# Altium project Telemetry_Board.PrjPcb
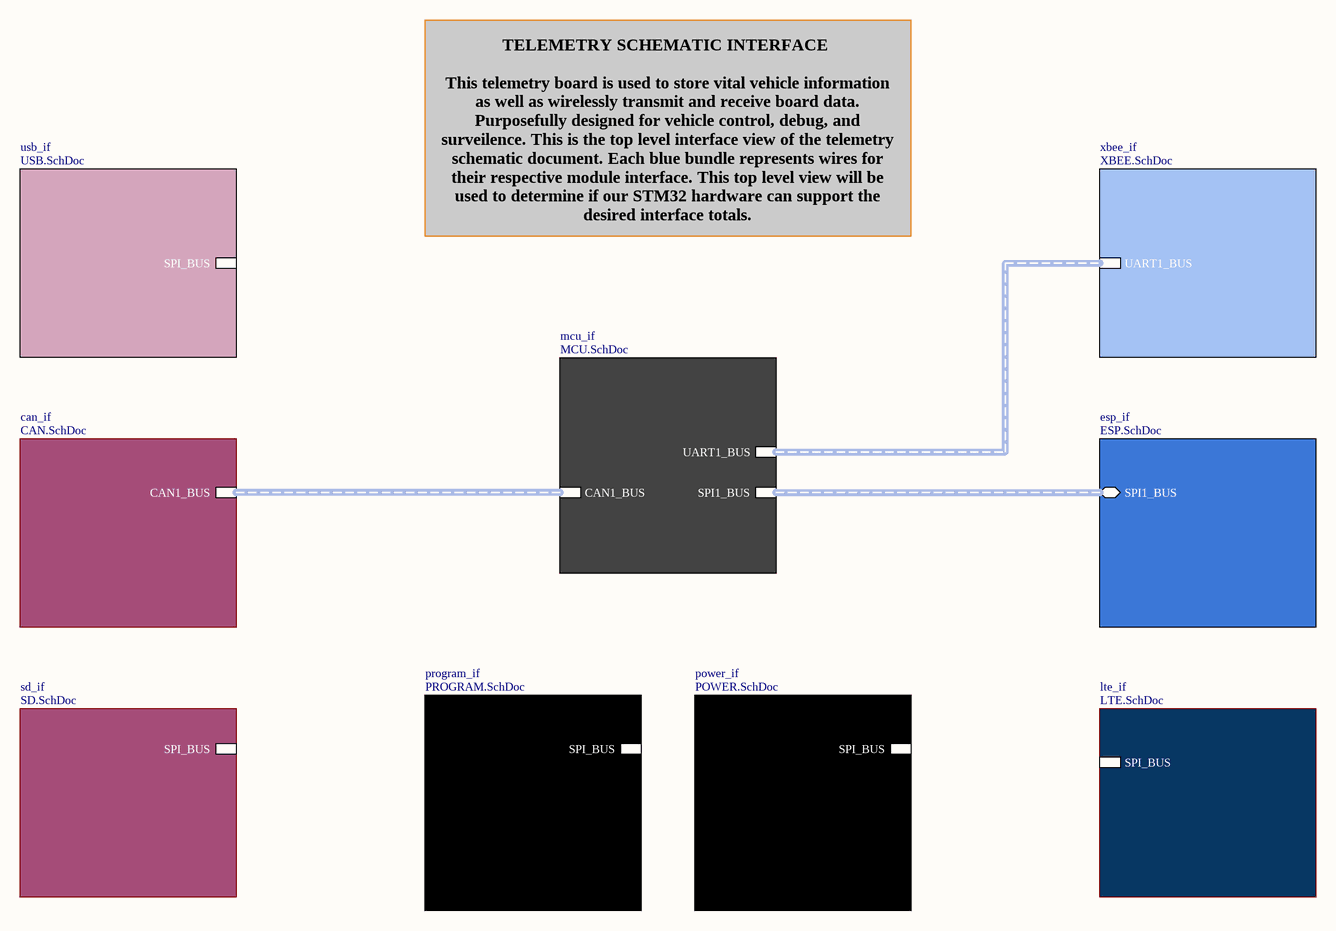
[diagram p0: Telemetry.SchDoc]
10 sheets, 38 parts. Net scope: hierarchical (ports join the sheet entries above them; power ports are global).
Board file: Telemetry.PcbDoc
Sheets:
  Telemetry.SchDoc
    mcu_if = MCU.SchDoc
    esp_if = ESP.SchDoc
    xbee_if = XBEE.SchDoc
    usb_if = USB.SchDoc
    can_if = CAN.SchDoc
    lte_if = LTE.SchDoc
    program_if = PROGRAM.SchDoc
    sd_if = SD.SchDoc
    power_if = POWER.SchDoc

## Sheet Telemetry.SchDoc
size 381 x 241 mm; SheetNumber: 1; SheetTotal: 10

### Sub-sheets
can_if = CAN.SchDoc: CAN1_BUS (harness SPI_BUS)
esp_if = ESP.SchDoc: SPI1_BUS (bidir, harness SPI_BUS)
lte_if = LTE.SchDoc: SPI_BUS (harness SPI_BUS)
mcu_if = MCU.SchDoc: SPI1_BUS (harness SPI_BUS), UART1_BUS (harness SPI_BUS), CAN1_BUS (harness SPI_BUS)
power_if = POWER.SchDoc: SPI_BUS (harness SPI_BUS)
program_if = PROGRAM.SchDoc: SPI_BUS (harness SPI_BUS)
sd_if = SD.SchDoc: SPI_BUS (harness SPI_BUS)
usb_if = USB.SchDoc: SPI_BUS (harness SPI_BUS)
xbee_if = XBEE.SchDoc: UART1_BUS (harness SPI_BUS)

### Buses and harness runs
harness sheet can_if/CAN1_BUS = sheet mcu_if/CAN1_BUS
harness sheet esp_if/SPI1_BUS = sheet mcu_if/SPI1_BUS
harness sheet mcu_if/UART1_BUS = sheet xbee_if/UART1_BUS

### Notes on the sheet
- TELEMETRY SCHEMATIC INTERFACE
  This telemetry board is used to store vital vehicle information as well as wirelessly transmit and receive board data. Purposefully designed for vehicle control, debug, and surveilence. This is the top level interface view of the telemetry schematic document. Each blue bundle represents wires for their respective module interface. This top level view will be used to determine if our STM32 hardware can support the desired interface totals.

## Sheet MCU.SchDoc
size A; SheetNumber: 2; SheetTotal: 9
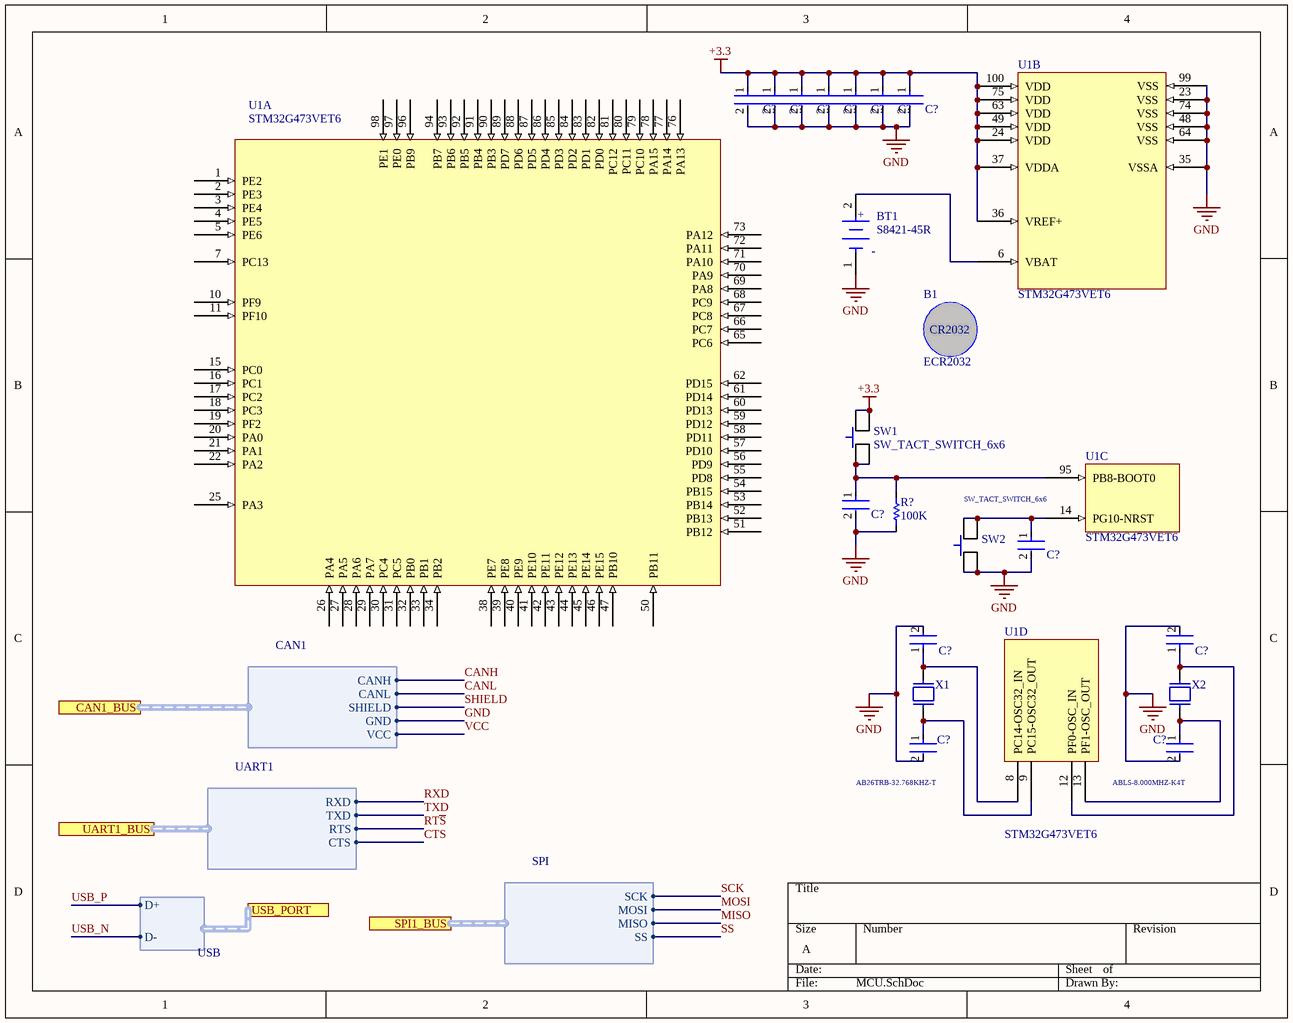
[diagram p1: MCU.SchDoc]

### Parts
(Parts that share a designator on the sheet are numbered #1, #2 ... from top to bottom, then left to right.)
B1  ECR2032
BT1  S8421-45R  [FP-S8421-45R-MFG]
C?#1  C0603C104K5RAC7411  [FP-C0603C-CF-IPC_B]  (value not drawn)
C?#2  C0603C104K5RAC7411  [FP-C0603C-CF-IPC_B]  (value not drawn)
C?#3  C0603C104K5RAC7411  [FP-C0603C-CF-IPC_B]  (value not drawn)
C?#4  C0603C104K5RAC7411  [FP-C0603C-CF-IPC_B]  (value not drawn)
C?#5  C0603C104K5RAC7411  [FP-C0603C-CF-IPC_B]  (value not drawn)
C?#6  C0603C104K5RAC7411  [FP-C0603C-CF-IPC_B]  (value not drawn)
C?#7  C0603C104K5RAC7411  [FP-C0603C-CF-IPC_B]  (value not drawn)
C?#8  C0603C104K5RAC7411  [FP-C0603C-CF-IPC_B]  (value not drawn)
C?#9  C0603C104K5RAC7411  [FP-C0603C-CF-IPC_B]  (value not drawn)
C?#10  C0603C104K5RAC7411  [FP-C0603C-CF-IPC_B]  (value not drawn)
C?#11  C0603C104K5RAC7411  [FP-C0603C-CF-IPC_B]  (value not drawn)
C?#12  C0603C104K5RAC7411  [FP-C0603C-CF-IPC_B]  (value not drawn)
C?#13  C0603C104K5RAC7411  [FP-C0603C-CF-IPC_B]  (value not drawn)
R?  value 100K  [0603_RESISTOR]  (hidden comment: R_0603_100K_1%)
SW1  SW_TACT_SWITCH_6x6  [TACT_SWITCH_6x6_J-LEAD]
SW2  SW_TACT_SWITCH_6x6  [TACT_SWITCH_6x6_J-LEAD]
U1  STM32G473VET6  [TSQFP50P1600X1600X160-100N]  (parts A,B,C,D of 4)
X1  AB26TRB-32.768KHZ-T  [X_2.1mm_RADIAL_CRYSTAL]
X2  ABLS-8.000MHZ-K4T  [ABLS-8.000MHZ-K4T-Footprint-1]

### Ports
CAN1_BUS (harness CAN1), SPI1_BUS (harness SPI), UART1_BUS (harness UART1), USB_PORT (harness USB)

### Harnesses
SPI: SCK, MOSI, MISO, SS
UART1: RXD, TXD, RTS, CTS
CAN1: CANH, CANL, SHIELD, GND, VCC
USB: D+, D-

### Nets
+3.3: C?#1.1 C?#2.1 C?#3.1 C?#4.1 C?#5.1 C?#6.1 C?#7.1 SW1.2 SW1.3 U1.24(VDD) U1.36(VREF+) U1.37(VDDA) U1.49(VDD) U1.63(VDD) U1.75(VDD) U1.100(VDD)
GND: BT1.1(C) C?#1.2 C?#2.2 C?#3.2 C?#4.2 C?#5.2 C?#6.2 C?#7.2 C?#8.2 C?#9.2 C?#10.2 C?#11.2 C?#12.2 C?#13.2 R?.1 SW2.1 SW2.4 U1.23(VSS) U1.35(VSSA) U1.48(VSS) U1.64(VSS) U1.74(VSS) ; port CAN1_BUS.GND
CANH: port CAN1_BUS.CANH
CANL: port CAN1_BUS.CANL
CTS: port UART1_BUS.CTS
MISO: port SPI1_BUS.MISO
MOSI: port SPI1_BUS.MOSI
RT~{S}: port UART1_BUS.RTS
RXD: port UART1_BUS.RXD
SCK: port SPI1_BUS.SCK
SHIELD: port CAN1_BUS.SHIELD
SS: port SPI1_BUS.SS
TXD: port UART1_BUS.TXD
USB_N: port USB_PORT.D-
USB_P: port USB_PORT.D+
VCC: port CAN1_BUS.VCC
NetBT1_2: BT1.2(A) U1.6(VBAT)
NetC?#8_1: C?#8.1 R?.2 SW1.1 SW1.4 U1.95(PB8-BOOT0)
NetC?#9_1: C?#9.1 SW2.2 SW2.3 U1.14(PG10-NRST)
NetC?#10_1: C?#10.1 U1.8(PC14-OSC32_IN) X1.1
NetC?#11_1: C?#11.1 U1.12(PF0-OSC_IN) X2.1
NetC?#12_1: C?#12.1 U1.9(PC15-OSC32_OUT) X1.2
NetC?#13_1: C?#13.1 U1.13(PF1-OSC_OUT) X2.2

Not connected (* = marked no-connect by the designer): U1 1(PE2) 2(PE3) 3(PE4) 4(PE5) 5(PE6) 7(PC13) 10(PF9) 11(PF10) 15(PC0) 16(PC1) 17(PC2) 18(PC3) 19(PF2) 20(PA0) 21(PA1) 22(PA2) 25(PA3) 26(PA4) 27(PA5) 28(PA6) 29(PA7) 30(PC4) 31(PC5) 32(PB0) 33(PB1) 34(PB2) 38(PE7) 39(PE8) 40(PE9) 41(PE10) 42(PE11) 43(PE12) 44(PE13) 45(PE14) 46(PE15) 47(PB10) 50(PB11) 51(PB12) 52(PB13) 53(PB14) 54(PB15) 55(PD8) 56(PD9) 57(PD10) 58(PD11) 59(PD12) 60(PD13) 61(PD14) 62(PD15) 65(PC6) 66(PC7) 67(PC8) 68(PC9) 69(PA8) 70(PA9) 71(PA10) 72(PA11) 73(PA12) 76(PA13) 77(PA14) 78(PA15) 79(PC10) 80(PC11) 81(PC12) 82(PD0) 83(PD1) 84(PD2) 85(PD3) 86(PD4) 87(PD5) 88(PD6) 89(PD7) 90(PB3) 91(PB4) 92(PB5) 93(PB6) 94(PB7) 96(PB9) 97(PE0) 98(PE1) 99(VSS)

### Notes on the sheet
- (in symbol CMP-001-0000-1) +; -
- (in symbol CMP-001-0001-1) CR2032

### Library data of the parts
B1 = CMP-001-0001-1: CR2032 BATTERY LITH 3V COIN 20MM STRIP
BT1 = CMP-001-0000-1: HARWIN - S8421-45R - HOLDER, COIN CELL, CR2032
C?#1-C?#13 = CMP-001-00083-3: Cap Ceramic 0.1uF 50V X7R 10% SMD 0603 125C T/R
R? = CMP-058-000032-1: RES 100K OHM 1/16W 1% 0603 SMD; Manufacturer: TE Connectivity Passive Product; Manufacturer Part Number: CPF0603F100KC1; Power Rating: 0.0625W; SVP Creator: Spencer Berglund; Source: resistor.SchLib; ComponentLink1Description: DigiKey; Design Item ID: R_0603_100K_1%; DigiKey PN: A102199TR-ND; Package: 0603_RESISTOR; ComponentLink1URL: https://www.digikey.com/products/en?keywords=A102199TR-ND
SW1 SW2 = CMP-050-000002-1: SWITCH TACT 6MM BLACK 160GF; SVP Creator: Spencer Berglund; Design Item ID: SW_TACT_SWITCH_6x6; Source: misc.SchLib; Package: 6mm x 6mm
U1 = CMP-00014-4: RISC Microcontroller, 32-Bit, 170MHz; Interface: JTAG; RAM Size: 128; Frequency: 170Hz; Nominal Supply Voltage: 3.3V; Case/Package: LQFP100; RoHS Compliant: Yes; Mounting Technology: SMD; Pins: 100
X1 = CMP-046-000002-2: CRYSTAL 32.7680KHZ 12.5PF SMD; Source: misc.SchLib; Design Item ID: X_32.768kHz_CRYSTAL
X2 = CMP-003-00030-1: ABRACON         ABLS-8.000MHZ-K4T             CRYSTAL, 8MHZ, 18PF, HC-49US

## Sheet ESP.SchDoc
size A; SheetNumber: 7; SheetTotal: 9
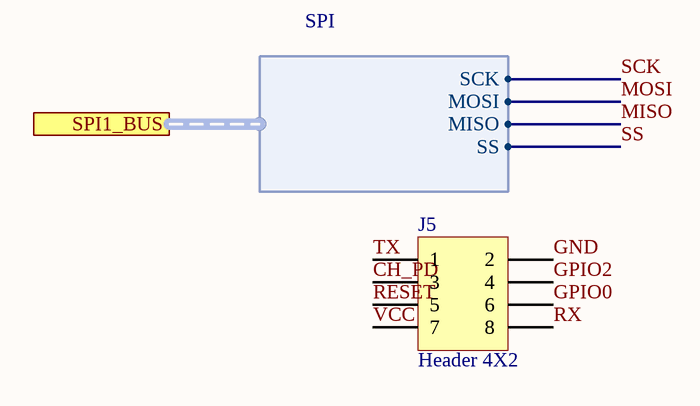
[diagram p2: ESP.SchDoc]

### Parts
J5  Header 4X2  [HDR2X4]

### Ports
SPI1_BUS (harness SPI)

### Harnesses
SPI: SCK, MOSI, MISO, SS

### Nets
CH_PD: J5.3
GND: J5.2
GPIO0: J5.6
GPIO2: J5.4
MISO: port SPI1_BUS.MISO
MOSI: port SPI1_BUS.MOSI
RESET: J5.5
RX: J5.8
SCK: port SPI1_BUS.SCK
SS: port SPI1_BUS.SS
TX: J5.1
VCC: J5.7

### Library data of the parts
J5 = Header 4X2: Header, 4-Pin, Dual row; LatestRevisionDate: 17-Jul-2002; LatestRevisionNote: Re-released for DXP Platform.; Publisher: Altium Limited

## Sheet XBEE.SchDoc
size A; SheetNumber: 6; SheetTotal: 10
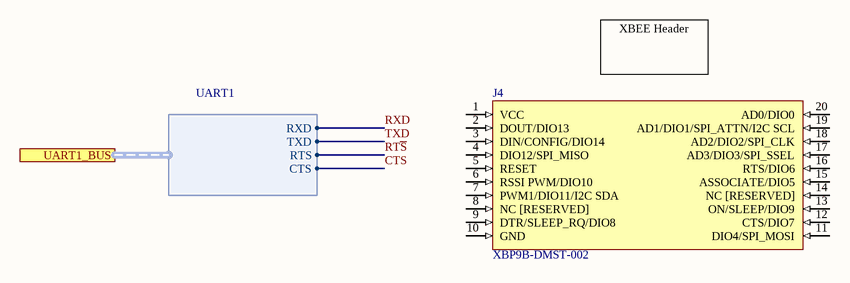
[diagram p3: XBEE.SchDoc]

### Parts
J4  XBP9B-DMST-002  [XBP9B-DMST-002-Footprint-1]

### Ports
UART1_BUS (harness UART1)

### Harnesses
UART1: RXD, TXD, RTS, CTS

### Nets

Not connected (* = marked no-connect by the designer): J4 1(VCC) 2(DOUT/DIO13) 3(DIN/CONFIG/DIO14) 4(DIO12/SPI_MISO) 5(RESET) 6(RSSI_PWM/DIO10) 7(PWM1/DIO11/I2C_SDA) 8(NC_[RESERVED]) 9(DTR/SLEEP_RQ/DIO8) 10(GND) 11(DIO4/SPI_MOSI) 12(CTS/DIO7) 13(ON/SLEEP/DIO9) 14(NC_[RESERVED]) 15(ASSOCIATE/DIO5) 16(RTS/DIO6) 17(AD3/DIO3/SPI_SSEL) 18(AD2/DIO2/SPI_CLK) 19(AD1/DIO1/SPI_ATTN/I2C_SCL) 20(AD0/DIO0)

### Notes on the sheet
- (near J4) XBEE Header

### Library data of the parts
J4 = CMP-00025-00003-1: 802.15.4 LR-WPAN SOC 928MHz 200Kbps

## Sheet USB.SchDoc
size A; SheetNumber: 4; SheetTotal: 9
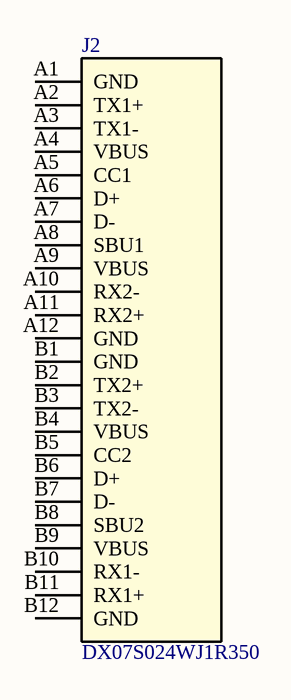
[diagram p4: USB.SchDoc]

### Parts
J2  DX07S024WJ1R350  [DX07S024WJ1R350-Footprint-1]

### Nets

Not connected (* = marked no-connect by the designer): J2 A1(GND) A2(TX1+) A3(TX1-) A4(VBUS) A5(CC1) A6(D+) A7(D-) A8(SBU1) A9(VBUS) A10(RX2-) A11(RX2+) A12(GND) B1(GND) B2(TX2+) B3(TX2-) B4(VBUS) B5(CC2) B6(D+) B7(D-) B8(SBU2) B9(VBUS) B10(RX1-) B11(RX1+) B12(GND)

### Library data of the parts
J2 = CMP-002-00075-3: Vertical Mount Type C receptacle; 12mm Height

## Sheet CAN.SchDoc
size A; SheetNumber: 3; SheetTotal: 9
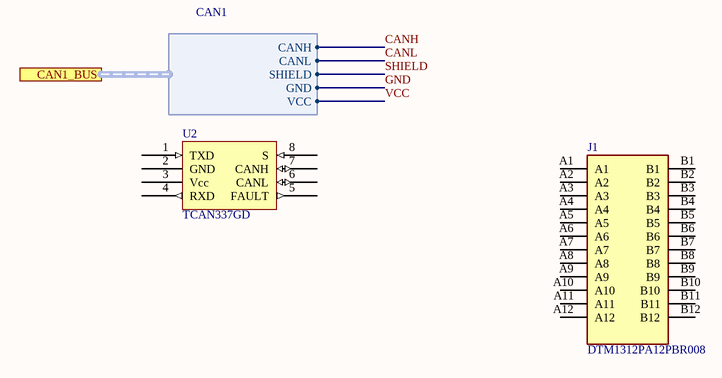
[diagram p5: CAN.SchDoc]

### Parts
J1  DTM1312PA12PBR008  [TE_DTM1312PA12PBR008]
U2  TCAN337GD  [TCAN337GD-Footprint-1]

### Ports
CAN1_BUS (harness CAN1)

### Harnesses
CAN1: CANH, CANL, SHIELD, GND, VCC

### Nets

Not connected (* = marked no-connect by the designer): J1 A1 A2 A3 A4 A5 A6 A7 A8 A9 A10 A11 A12 B1 B2 B3 B4 B5 B6 B7 B8 B9 B10 B11 B12; U2 1(TXD) 2(GND) 3(Vcc) 4(RXD) 5(FAULT) 6(CANL) 7(CANH) 8(S)

### Library data of the parts
J1 = CMP-002-00081-2: 24 way sealed A and B key PCB header with .165 inch/4.2 millimeter centerline pitch.; MP: DTM13-12PA-12PB-R008; MF: TE Connectivity; Component Type: Standard; Design Item ID: DTM1312PA12PBR008; Value: *; TE_purchase_URL: https://www.te.com/usa-en/product-DTM1312PA12PBR008.html?te_bu=Cor&te_type=disp&te_campaign=seda_glo_cor-seda-global-disp-prtnr-fy19-seda-model-bom-cta_sma-317_1&elqCampaignId=32493; Source: SnapEDAsch.SchLib; Pins: 24; Digi-Key_Part_Number: 1734-1131-ND; Case/Package: None; SnapEDA_Link: https://www.snapeda.com/parts/DTM13-12PA-12PB-R008/TE%20Connectivity%20Deutsch%20Connectors/view-part/490507/?ref=snap; Digi-Key_Purchase_URL: https://www.digikey.com/product-detail/en/te-connectivity-deutsch-connectors/DTM13-12PA-12PB-R008/1734-1131-ND/6566695?utm_source=snapeda&utm_medium=aggregator&utm_campaign=symbol
U2 = CMP-015-00008-1: 3.3-V CAN Transceivers with CAN FD (Flexible Data Rate) 8-SOIC -40 to 125 +-

## Sheet LTE.SchDoc
size A; SheetNumber: 7; SheetTotal: 9

## Sheet PROGRAM.SchDoc
size A; SheetNumber: 9; SheetTotal: 10
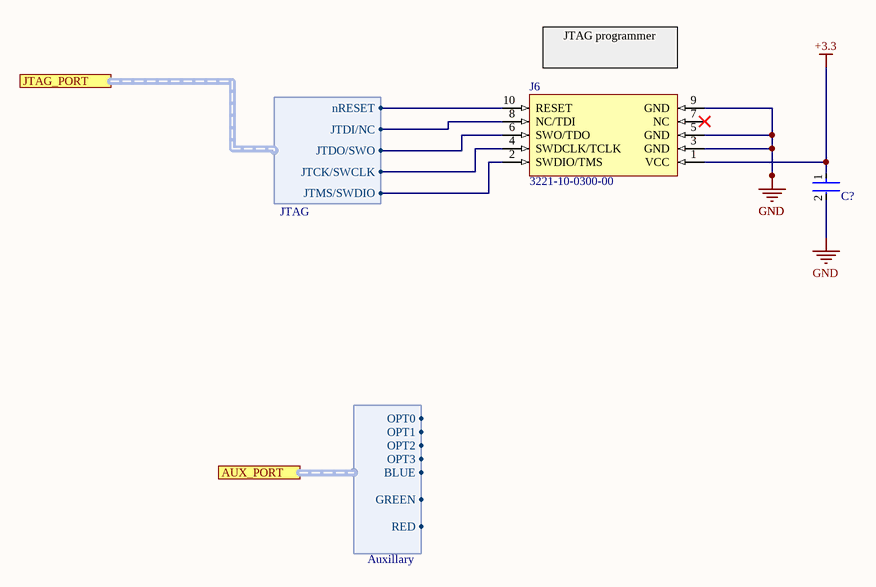
[diagram p6: PROGRAM.SchDoc]

### Parts
(Parts that share a designator on the sheet are numbered #1, #2 ... from top to bottom, then left to right.)
C?#14  C0603C104K5RAC7411  [FP-C0603C-CF-IPC_B]  (value not drawn)
J6  3221-10-0300-00  [3221-10-0300-00-Footprint-1]

### Ports
AUX_PORT (harness Auxillary), JTAG_PORT (harness JTAG)

### Harnesses
Auxillary: OPT0, OPT1, RED, GREEN, BLUE, OPT2, OPT3
JTAG: JTMS/SWDIO, JTCK/SWCLK, JTDO/SWO, JTDI/NC, nRESET

### Nets
+3.3: C?#14.1 J6.1(VCC)
GND: C?#14.2 J6.3(GND) J6.5(GND) J6.9(GND)
NetJ6_2: J6.2(SWDIO/TMS) ; port JTAG_PORT.JTMS/SWDIO
NetJ6_4: J6.4(SWDCLK/TCLK) ; port JTAG_PORT.JTCK/SWCLK
NetJ6_6: J6.6(SWO/TDO) ; port JTAG_PORT.JTDO/SWO
NetJ6_8: J6.8(NC/TDI) ; port JTAG_PORT.JTDI/NC
NetJ6_10: J6.10(RESET) ; port JTAG_PORT.nRESET

Not connected (* = marked no-connect by the designer): J6 7(NC)*

### Notes on the sheet
- (near J6) JTAG programmer

### Library data of the parts
C?#14 = CMP-001-00083-3: as C?#1 on sheet MCU
J6 = CMP-002-00077-1: JTAG STLINK CONN HEADER SMD 10POS 1.27MM

## Sheet SD.SchDoc
size A; SheetNumber: 5; SheetTotal: 9
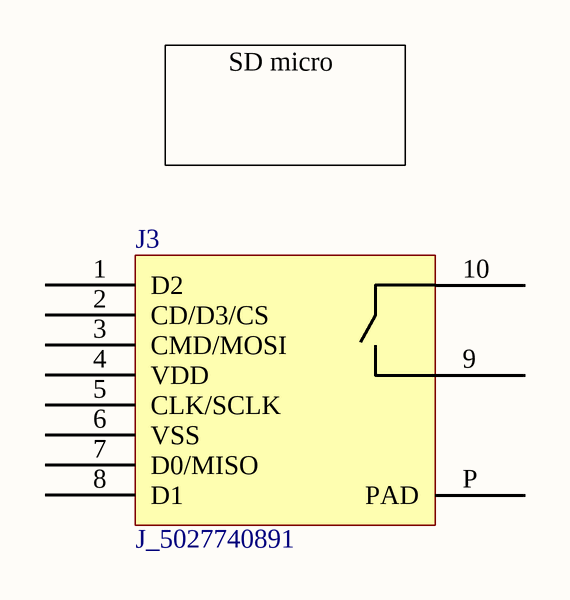
[diagram p7: SD.SchDoc]

### Parts
J3  J_5027740891  [usd slot 5027740891]

### Nets

Not connected (* = marked no-connect by the designer): J3 1(D2) 2(CD/D3/CS) 3(CMD/MOSI) 4(VDD) 5(CLK/SCLK) 6(VSS) 7(D0/MISO) 8(D1) 9 10 P(PAD)

### Notes on the sheet
- SD micro

### Library data of the parts
J3 = CMP-142-000000-4: CONN MICRO SD CARD PUSH-PUSH R/A; Max Current Rating: 500mA; Gender: Female; Mounting Technology: SMT; Pins: 12

## Sheet POWER.SchDoc
size A; SheetNumber: 10; SheetTotal: 10
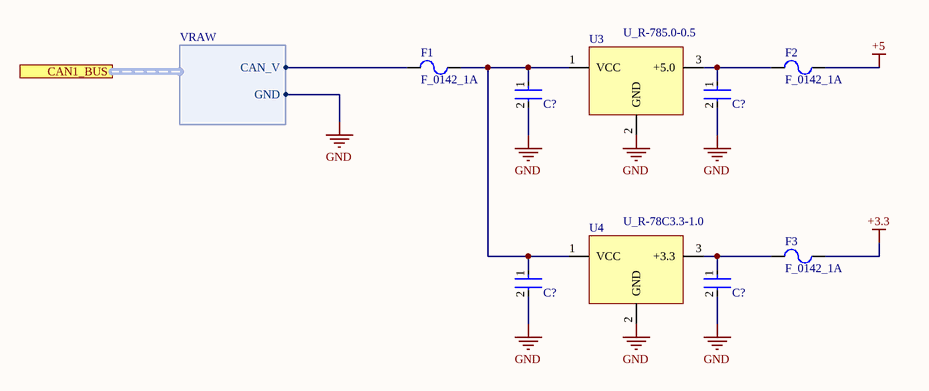
[diagram p8: POWER.SchDoc]

### Parts
(Parts that share a designator on the sheet are numbered #1, #2 ... from top to bottom, then left to right.)
C?#15  C0603C104K5RAC7411  [FP-C0603C-CF-IPC_B]  (value not drawn)
C?#16  C0603C104K5RAC7411  [FP-C0603C-CF-IPC_B]  (value not drawn)
C?#17  C0603C104K5RAC7411  [FP-C0603C-CF-IPC_B]  (value not drawn)
C?#18  C0603C104K5RAC7411  [FP-C0603C-CF-IPC_B]  (value not drawn)
F1  F_0142_1A  [0154_FUSE_HOLDER]
F2  F_0142_1A  [0154_FUSE_HOLDER]
F3  F_0142_1A  [0154_FUSE_HOLDER]
U3  U_R-785.0-0.5  [SIP3]
U4  U_R-78C3.3-1.0  [SIP3]

### Ports
CAN1_BUS (harness VRAW)

### Harnesses
VRAW: CAN_V, GND

### Nets
+3.3: F3.2
+5: F2.2
GND: C?#15.2 C?#16.2 C?#17.2 C?#18.2 U3.2(GND) U4.2(GND)
NetC?#15_1: C?#15.1 C?#17.1 F1.2 U3.1(VCC) U4.1(VCC)
NetC?#16_1: C?#16.1 F2.1 U3.3(+5.0)
NetC?#18_1: C?#18.1 F3.1 U4.3(+3.3)

Not connected (* = marked no-connect by the designer): F1 1

### Library data of the parts
C?#15-C?#18 = CMP-001-00083-3: as C?#1 on sheet MCU
F1-F3 = CMP-047-000000-1: Fuse Block 10A 125V 1 Circuit Cartridge Surface Mount; Manufacturer: Littelfuse Inc.; SVP Creator: Spencer Berglund; Current: 1A; Design Item ID: F_0142_1A; DigiKey PN: F1889-ND; Source: misc.SchLib
U3 = CMP-110-000001-1: IC REG 0.5A 5.0V; Manufacturer: Recom Power; SVP Creator: Vivien Wang; ComponentLink1URL: http://www.digikey.com/product-search/en?vendor=0&keywords=R-785.0-0.5; Manufacturer PN: R-785.0-0.5; Design Item ID: U_R-785.0-0.5; ComponentLink1Description: Datasheet; Source: Common.SchLib; Price: 6.81; Known Distributors: Digikey
U4 = CMP-093-000004-1: IC REG 1A 3.3V; Manufacturer: Recom Power; Voltage - Input (Max): 42V; Efficiency: 89%; SVP Creator: Vivien Wang; Voltage - Input (Min): 7V; Source: BP_Control.SchLib; Size / Dimension: 0.45" L x 0.30" W x 0.40" H (11.5mm x 7.5mm x 10.2mm); Design Item ID: U_R-78C3.3-1.0; Voltage - Output 1: 3.3V; Manufacturer PN: R-78C3.3-1.0; Current - Output (Max): 1A

## Nets that join several sheets
+3.3: MCU (16 pins), PROGRAM (C?#14.1 J6.1), POWER (F3.2)
GND: MCU (22 pins), PROGRAM (C?#14.2 J6.3 J6.5 J6.9), POWER (6 pins)